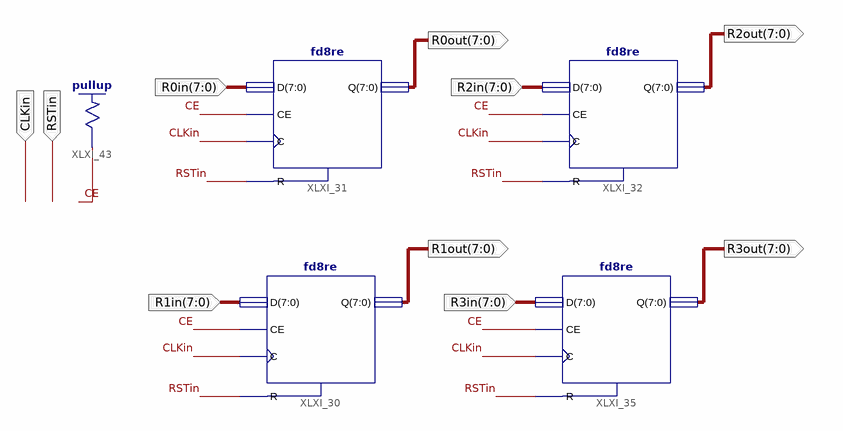
[diagram p0: schematic sheet 1]
// Xilinx ISE schematic WorkingRegisters.sch (spartan3e) as structural Verilog: 5 symbols, 10 ports
module WorkingRegisters (
  input  RSTin,
  input  CLKin,
  input  [7:0] R0in,
  input  [7:0] R1in,
  input  [7:0] R2in,
  input  [7:0] R3in,
  output [7:0] R0out,
  output [7:0] R1out,
  output [7:0] R2out,
  output [7:0] R3out
);

  wire CE;

  fd8re XLXI_31 (.C(CLKin), .CE(CE), .D(R0in), .R(RSTin), .Q(R0out));
  fd8re XLXI_30 (.C(CLKin), .CE(CE), .D(R1in), .R(RSTin), .Q(R1out));
  fd8re XLXI_32 (.C(CLKin), .CE(CE), .D(R2in), .R(RSTin), .Q(R2out));
  fd8re XLXI_35 (.C(CLKin), .CE(CE), .D(R3in), .R(RSTin), .Q(R3out));
  \pullup  XLXI_43 (.O(CE));
endmodule
